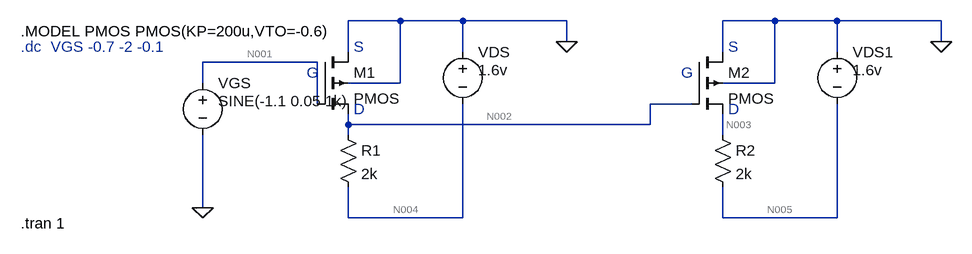
[diagram p0: schematic cascaded pmos.asc]
cascaded pmos.asc, the LTspice schematic file:
Version 4
SHEET 1 1108 680
WIRE 256 -16 176 -16
WIRE 352 -16 256 -16
WIRE 512 -16 352 -16
WIRE 832 -16 752 -16
WIRE 928 -16 832 -16
WIRE 1088 -16 928 -16
WIRE 512 16 512 -16
WIRE 1088 16 1088 -16
WIRE 176 32 176 -16
WIRE 352 32 352 -16
WIRE 752 32 752 -16
WIRE 928 32 928 -16
WIRE 128 48 -48 48
WIRE -48 80 -48 48
WIRE 256 80 256 -16
WIRE 256 80 176 80
WIRE 832 80 832 -16
WIRE 832 80 752 80
WIRE 128 112 128 48
WIRE 704 112 640 112
WIRE 176 144 176 128
WIRE 640 144 640 112
WIRE 640 144 176 144
WIRE 176 160 176 144
WIRE 752 160 752 128
WIRE -48 272 -48 160
WIRE 176 288 176 240
WIRE 352 288 352 112
WIRE 352 288 176 288
WIRE 752 288 752 240
WIRE 928 288 928 112
WIRE 928 288 752 288
FLAG -48 272 0
FLAG 512 16 0
FLAG 1088 16 0
SYMBOL voltage 352 16 R0
WINDOW 123 0 0 Left 0
WINDOW 39 0 0 Left 0
WINDOW 3 24 44 Left 2
SYMATTR Value 1.6v
SYMATTR InstName VDS
SYMBOL voltage -48 64 R0
WINDOW 123 0 0 Left 0
WINDOW 39 0 0 Left 0
WINDOW 3 24 44 Left 2
SYMATTR Value SINE(-1.1 0.05 1k)
SYMATTR InstName VGS
SYMBOL res 160 144 R0
SYMATTR InstName R1
SYMATTR Value 2k
SYMBOL pmos4 128 32 R0
SYMATTR InstName M1
SYMATTR Value2 l=1u w=10u
SYMBOL voltage 928 16 R0
WINDOW 123 0 0 Left 0
WINDOW 39 0 0 Left 0
WINDOW 3 24 44 Left 2
SYMATTR Value 1.6v
SYMATTR InstName VDS1
SYMBOL res 736 144 R0
SYMATTR InstName R2
SYMATTR Value 2k
SYMBOL pmos4 704 32 R0
SYMATTR InstName M2
SYMATTR Value2 l=1u w=10u
TEXT 184 120 Left 2 ;D
TEXT 112 64 Left 2 ;G
TEXT 184 24 Left 2 ;S
TEXT -328 0 Left 2 !.MODEL PMOS PMOS(KP=200u,VTO=-0.6)
TEXT -328 24 Left 2 ;.dc  VGS -0.7 -2 -0.1
TEXT -328 296 Left 2 !.tran 1
TEXT 760 120 Left 2 ;D
TEXT 688 64 Left 2 ;G
TEXT 760 24 Left 2 ;S

The netlist it stands for:
* cascaded pmos.asc
VDS 0 N004 1.6v
VGS N001 0 SINE(-1.1 0.05 1k)
R1 N002 N004 2k
M1 0 N001 N002 0 PMOS l=1u w=10u
VDS1 0 N005 1.6v
R2 N003 N005 2k
M2 0 N002 N003 0 PMOS l=1u w=10u
.model NMOS NMOS
.model PMOS PMOS
.lib standard.mos
* D
* G
* S
.MODEL PMOS PMOS(KP=200u,VTO=-0.6)
* .dc  VGS -0.7 -2 -0.1
.tran 1
* D
* G
* S
.backanno
.end

* Results of the author's LTspice run, read from the files saved beside the schematic
* Operating Point, zero values left out:
*   V(n004) = -1.6 V
*   V(n001) = -1.1 V
*   V(n002) = -1.1 V
*   V(n005) = -1.6 V
*   V(n003) = -1.1 V
*   Id(M2) = 250 µA
*   Ib(M2) = 1.11 pA
*   Is(M2) = -250 µA
*   Id(M1) = 250 µA
*   Ib(M1) = 1.11 pA
*   Is(M1) = -250 µA
*   I(R2) = 250 µA
*   I(R1) = 250 µA
*   I(Vds1) = -250 µA
*   I(Vds) = -250 µA
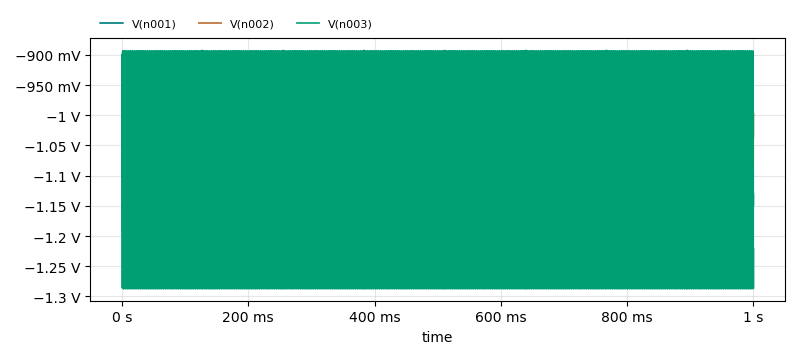
[diagram p1: Transient Analysis of cascaded pmos.asc, plotted from the saved traces]
* Transient Analysis, 1 run:
*   V(n001): min -1.15 V, max -1.05 V, average -1.1 V, rms 1.101 V, last -1.1 V
*   V(n002): min -1.195 V, max -995.4 mV, average -1.097 V, rms 1.1 V, last -1.1 V
*   V(n003): min -1.287 V, max -892.6 mV, average -1.095 V, rms 1.103 V, last -1.1 V